# EAGLE design JTAG adapter (EAGLE 5.12)
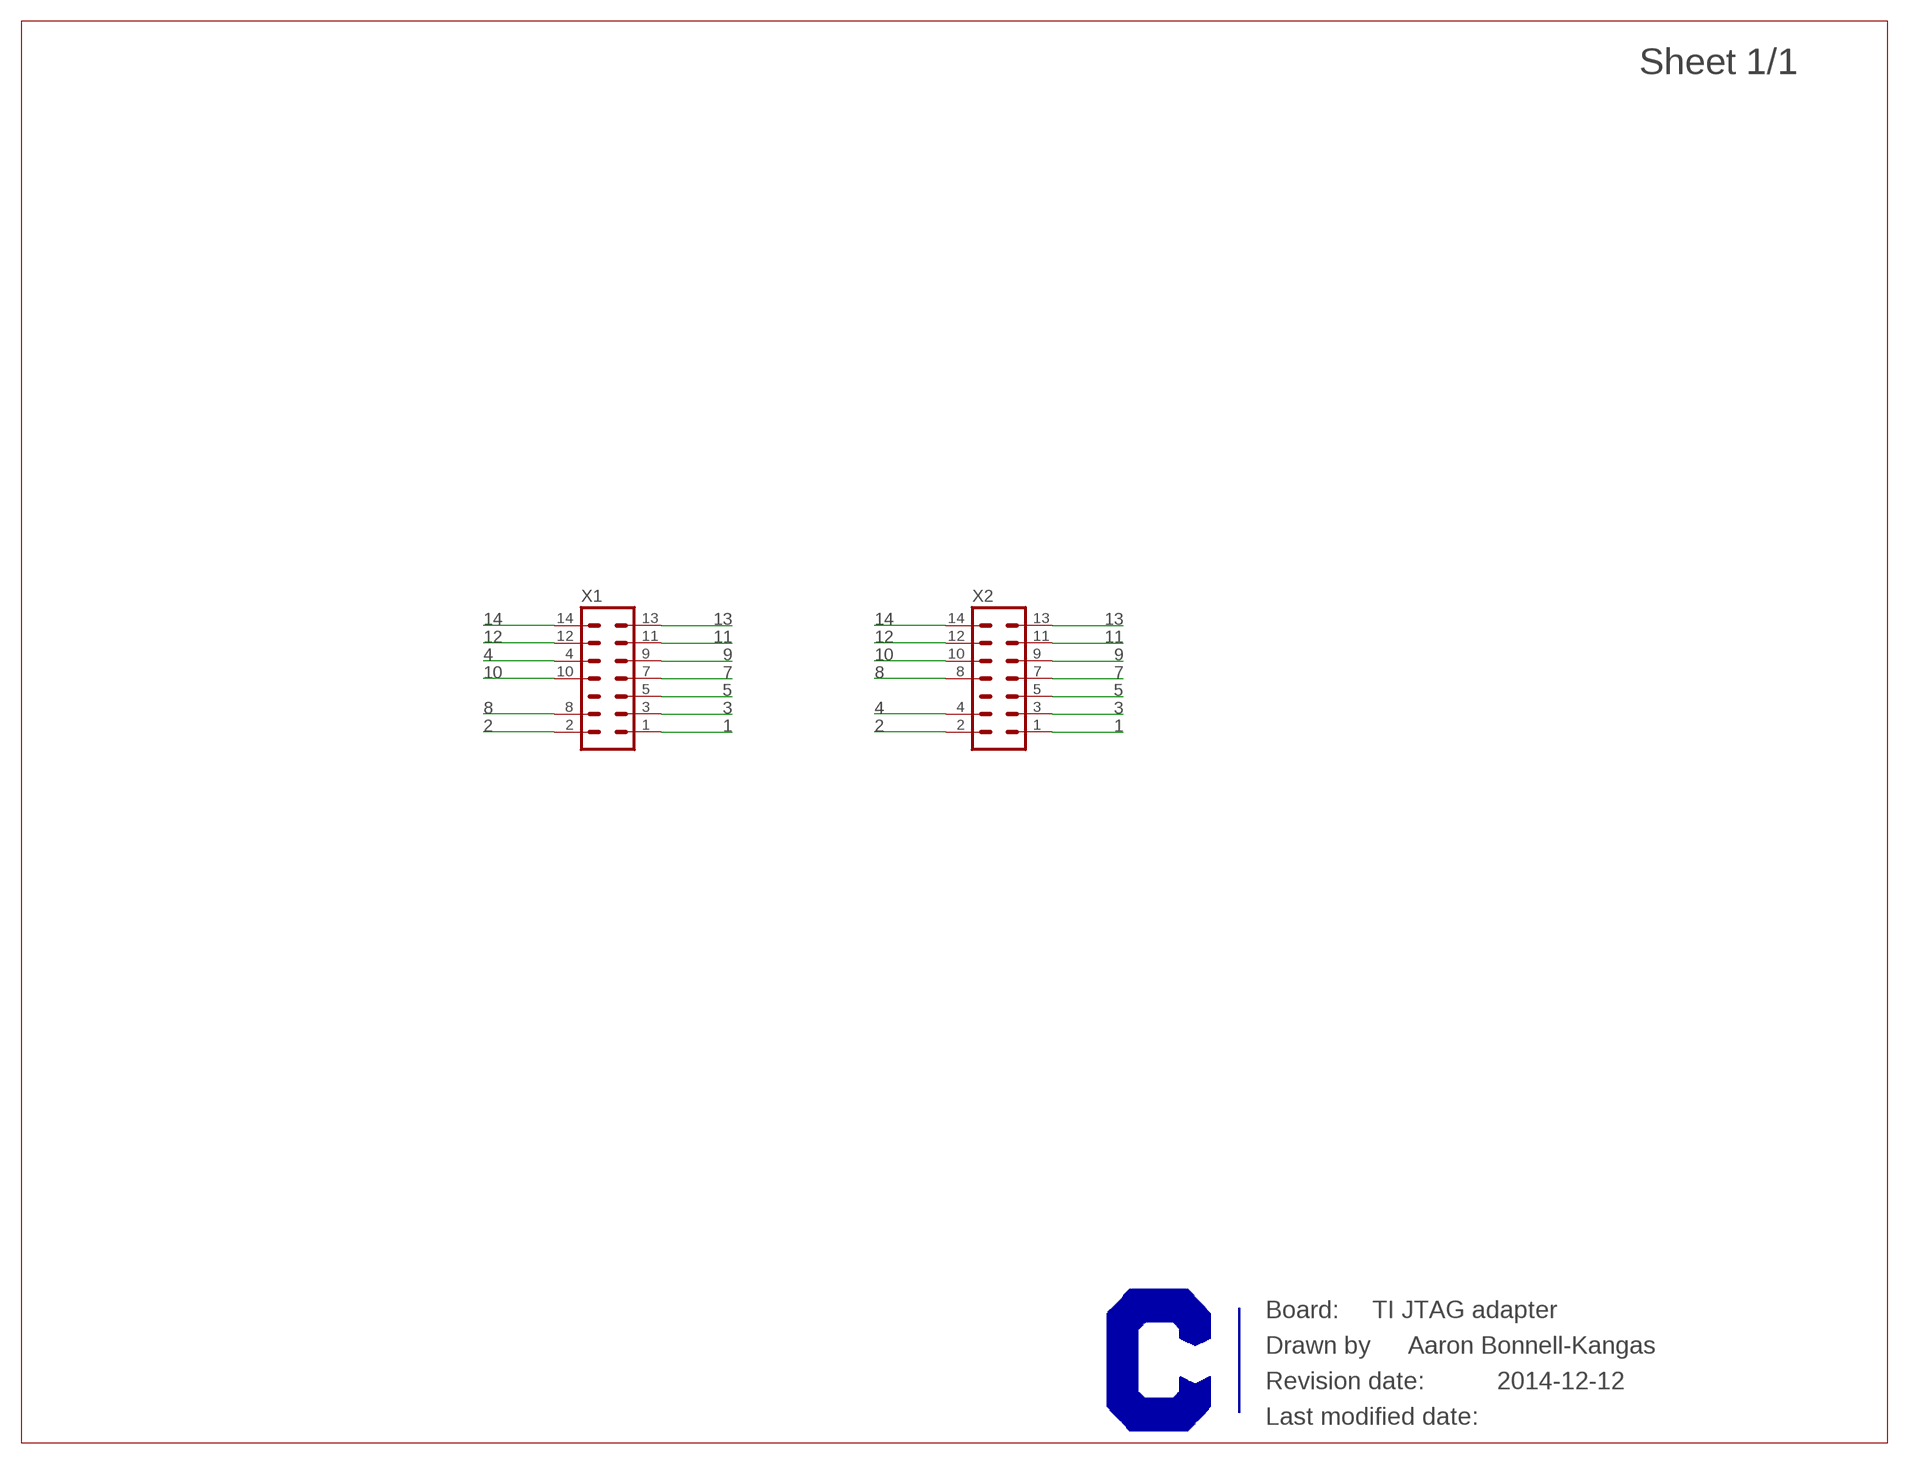
[diagram p0: schematic, sheet 1]

## Parts
U$1  CURRENT-C-LETTER-LANDSCAPE  [BLANK]
X1  JTAG_HEADER-0.05"-SMT-VERT  [TI_JTAG_HEADER_0.05"_SMT]
X2  JTAG_HEADER  [TI_JTAG_HEADER]

## Nets
1: X1.1(TMS) X2.1(TMS)
2: X1.2(!TRST) X2.2(!TRST)
3: X1.3(TDI) X2.3(TDI)
4: X1.4(GND) X2.4(GND)
5: X1.5(VTREF) X2.5(VTREF)
7: X1.7(TDO) X2.7(TDO)
8: X1.8(GND) X2.8(GND)
9: X1.9(TCK) X2.9(TCK)
10: X1.10(GND) X2.10(GND)
11: X1.11 X2.11
12: X1.12(GND) X2.12(GND)
13: X1.13(EMU0) X2.13(EMU0)
14: X1.14(EMU1) X2.14(EMU1)

## Notes on the sheet
- TI JTAG adapter
- Aaron Bonnell-Kangas
- 2014-12-12

## Library data of the parts
U$1 = Frames:CURRENT-C-LETTER-LANDSCAPE; BOM: EXCLUDE
X1 = TI:JTAG_HEADER: TI 14-pin JTAG header Reference: http://processors.wiki.ti.com/index.php/JTAG_Connectors; PARTNO: FTS-107-01-F-DV
X2 = TI:JTAG_HEADER: TI 14-pin JTAG header Reference: http://processors.wiki.ti.com/index.php/JTAG_Connectors

## Board
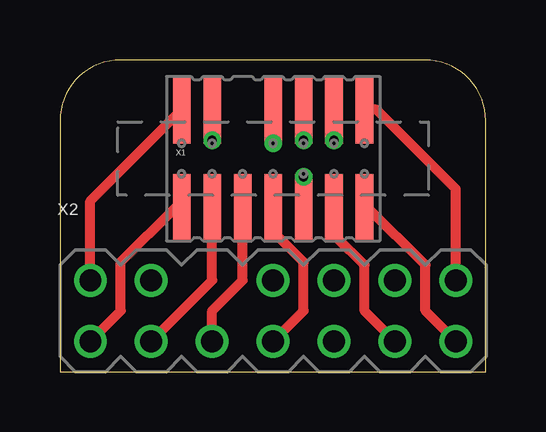
[diagram p1: board, top side]
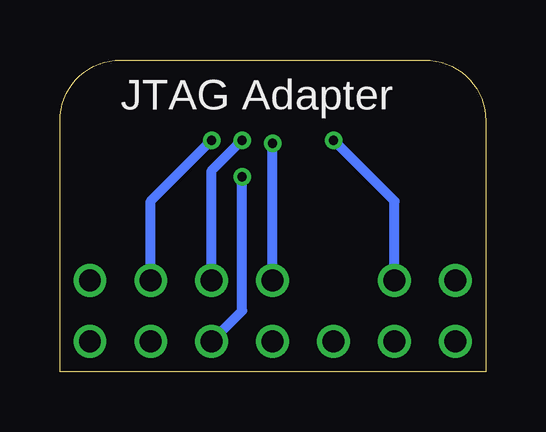
[diagram p2: board, bottom side, seen from below]

Size 17.76 x 13.01 mm. Coordinates in mm from the lower left corner, seen from the top.
Outline: 0,0 17.76,0 17.76,10.46 arc90 15.22,13.01 2.54,13.01 arc90 0,10.46 0,0
Copper layers (1*16): Top 0.0356mm / dielectric 1.5011mm / Bottom 0.0356mm
Design rules "OSH Park 2-layer": minimum track width 6mil, minimum drill 13mil, track to track 6mil, track to pad 6mil, pad to pad 6mil, via to via 6mil, smd to smd 6mil, copper to edge 15mil, drill to drill 6mil, minimum pad ring 7mil, minimum via ring 7mil, stop-mask expansion 4mil, vias tented up to drill 0mil, thermal gap 10mil

### Footprints (pad centres in the part's own frame; a part is rotated, then mirrored left to right if it is on the bottom)
TI_JTAG_HEADER_0.05"_SMT = smd 0.737 x 2.794: 1 -3.81,-2.032; 2 -3.81,2.032; 3 -2.54,-2.032; 4 -2.54,2.032; 5 -1.27,-2.032; 7 0,-2.032; 8 0,2.032; 9 1.27,-2.032; 10 1.27,2.032; 11 2.54,-2.032; 12 2.54,2.032; 13 3.81,-2.032; 14 3.81,2.032
TI_JTAG_HEADER = drill 0.914 round: 1 -7.62,-1.27; 2 -7.62,1.27; 3 -5.08,-1.27; 4 -5.08,1.27; 5 -2.54,-1.27; 7 0,-1.27; 8 0,1.27; 9 2.54,-1.27; 10 2.54,1.27; 11 5.08,-1.27; 12 5.08,1.27; 13 7.62,-1.27; 14 7.62,1.27

### Placement (x,y rotation side)
U$1  0,0 0 top
X1  8.89,8.89 0 top
X2  8.89,2.54 0 top

### Tracks (layer width: path | path; a pad name or v marks a point on that pad's centre or on a via)
1
  Top 0.406: X2.1 2.54,2.54 2.54,4.57 4.83,6.86 X1.1
2
  Top 0.406: X2.2 1.27,7.11 X1.2
3
  Top 0.406: X2.3 6.35,3.81 X1.3
4  (via drill 0.38)
  Top 0.406: v6.35,9.65 X1.4
  Bottom 0.406: X2.4 3.81,7.11 v6.35,9.65
5
  Top 0.406: X2.5 6.35,2.54 7.62,3.81 X1.5
7
  Top 0.406: X2.7 10.16,2.54 10.16,4.57 9.02,5.71 8.89,5.71 X1.7
8  (via drill 0.38)
  Top 0.406: v8.89,9.53 X1.8
  Bottom 0.406: X2.8 v8.89,9.53
9  (via drill 0.38)
  Top 0.406: 10.16,8.26 v10.16,8.13 10.16,7.62 | 10.16,7.62 10.03,7.49 10.03,6.73 X1.9 10.16,7.62
  Bottom 0.406: X2.9 10.16,2.54 v10.16,8.13 10.16,8.26
10  (via drill 0.38)
  Top 0.406: v10.16,9.65 X1.10
  Bottom 0.406: X2.10 11.43,8.38 v10.16,9.65
11
  Top 0.406: X2.11 12.7,2.54 12.7,4.45 11.56,5.59 11.43,5.59 X1.11
12  (via drill 0.38)
  Top 0.406: v11.43,9.65 X1.12
  Bottom 0.406: X2.12 13.97,7.11 v11.43,9.65
13
  Top 0.406: X2.13 15.24,2.54 15.24,4.45 12.83,6.86 X1.13
14
  Top 0.406: X2.14 16.51,7.62 13.21,10.92 X1.14

### Text on the board
bPlace: JTAG Adapter